# Altium schematic sheet ethernet.SchDoc (part 3 of 3)
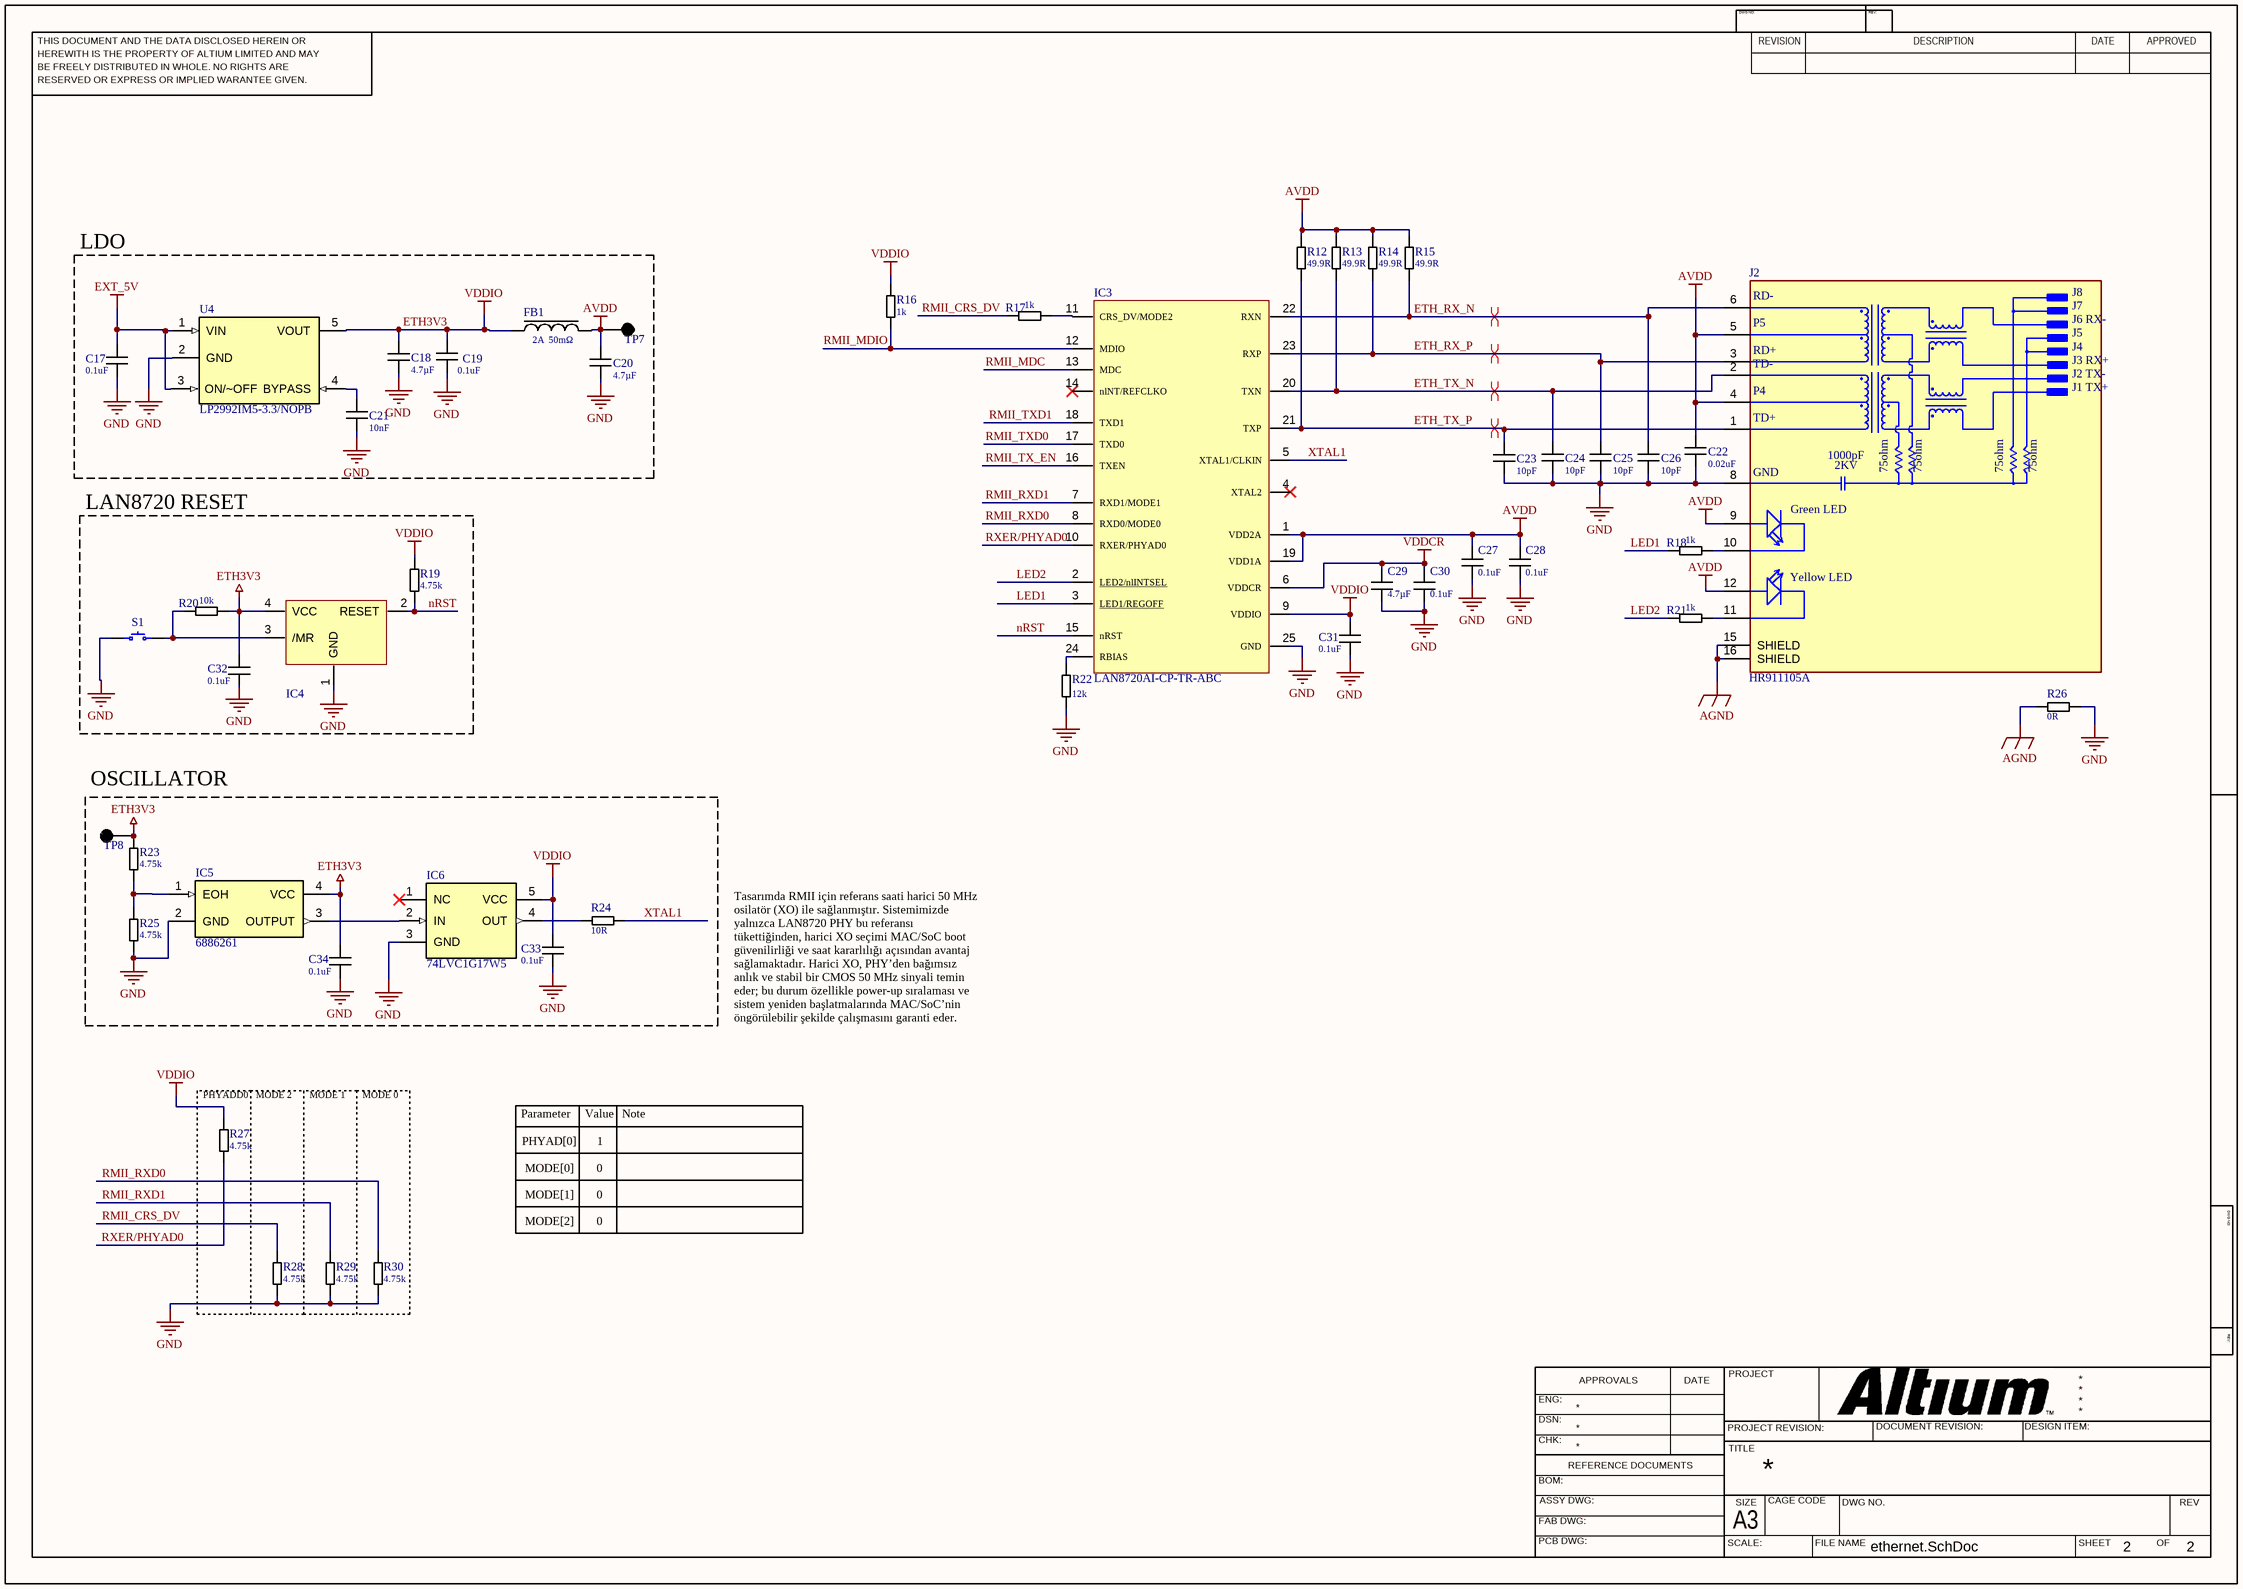
[diagram p2: ethernet.SchDoc]

## Library data of the parts (continued)
R12-R15 = RES 49.9 OHM 0603: 100Mw Thick Film Resistors 100Ppm/ 1% 49.9 0603 Chip Resistor Surface Mount Rohs; Manufacturer: Panasonic; Temperature Coefficient: 100ppm/°C; Voltage Rating: 75V; Supplier 1: Farnell; Manufacturer Part Number: ERJ-3EKF49R9V; RoHS: Compliant; Category: Chip SMD Resistors; Stock 1: 255000; Pricing 1: 5000=0,0084 (EUR); Case/Package: 0603; Case Code (Imperial): 0603; China RoHS: Non-Compliant; Composition: Thick Film; Contact Plating: Tin; Depth: 800µm; Features: Automotive AEC-Q200; Height: 450µm; Length: 1.6mm; Lifecycle Status: Production; Max Operating Temperature: 155°C; Max Power Dissipation: 100mW; Military Standard: Not; Min Operating Temperature: -55°C; Mount: Surface Mount; Number of Terminals: 2; Number of Terminations: 2; Packaging: Cut Tape; Power Dissipation: 100mW; Power Rating: 100mW; Radiation Hardening: No; REACH SVHC: Yes; Schedule B: 8533210045, 8533210045|8533210045|8533210045|8533210045|8533210045, 8533210045|8533210045|8533210045|8533210045|8533210045|8533210045, 8533210045|8533210045|8533210045|8533210045|8533210045|8533210045|8533210045|8533210045; Termination: SMD/SMT; Tolerance: 1%; Width: 800µm; Working Voltage: 75V; ComponentLink1URL: https://datasheet.octopart.com:443/ERJ-3EKF49R9V-Panasonic-datasheet-82288794.pdf?src-supplier=Panasonic+SCT; ComponentLink1Description: https://datasheet.octopart.com:443/ERJ-3EKF49R9V-Panasonic-datasheet-82288794.pdf?src-supplier=Panasonic+SCT; ComponentLink2URL: https://datasheet.octopart.com:443/ERJ-3EKF49R9V-Panasonic-datasheet-13266541.pdf?src-supplier=RS+(Formerly+Allied+Electronics); ComponentLink2Description: https://datasheet.octopart.com:443/ERJ-3EKF49R9V-Panasonic-datasheet-13266541.pdf?src-supplier=RS+(Formerly+Allied+Electronics); ComponentLink3URL: https://datasheet.octopart.com:443/ERJ-3EKF49R9V-Panasonic-datasheet-5313456.pdf?src-supplier=element14+APAC; ComponentLink3Description: https://datasheet.octopart.com:443/ERJ-3EKF49R9V-Panasonic-datasheet-5313456.pdf?src-supplier=element14+APAC; ComponentLink4URL: https://datasheet.octopart.com:443/ERJ-3EKF49R9V-Panasonic-datasheet-10025800.pdf?src-supplier=element14+APAC; ComponentLink4Description: https://datasheet.octopart.com:443/ERJ-3EKF49R9V-Panasonic-datasheet-10025800.pdf?src-supplier=element14+APAC; ComponentLink5URL: https://datasheet.octopart.com:443/ERJ-3EKF49R9V-Panasonic-datasheet-8853621.pdf?src-supplier=element14+APAC; ComponentLink5Description: https://datasheet.octopart.com:443/ERJ-3EKF49R9V-Panasonic-datasheet-8853621.pdf?src-supplier=element14+APAC; ComponentLink6URL: https://datasheet.octopart.com:443/ERJ-3EKF49R9V-Panasonic-datasheet-48891056.pdf?src-supplier=Newark; ComponentLink6Description: https://datasheet.octopart.com:443/ERJ-3EKF49R9V-Panasonic-datasheet-48891056.pdf?src-supplier=Newark; ComponentLink7URL: https://datasheet.octopart.com:443/ERJ-3EKF49R9V-Panasonic-datasheet-168681906.pdf?src-supplier=Newark; ComponentLink7Description: https://datasheet.octopart.com:443/ERJ-3EKF49R9V-Panasonic-datasheet-168681906.pdf?src-supplier=Newark; ComponentLink8URL: https://datasheet.octopart.com:443/ERJ-3EKF49R9V-Panasonic-datasheet-136608610.pdf?src-supplier=Farnell; ComponentLink8Description: https://datasheet.octopart.com:443/ERJ-3EKF49R9V-Panasonic-datasheet-136608610.pdf?src-supplier=Farnell; ComponentLink9URL: https://datasheet.octopart.com:443/ERJ-3EKF49R9V-Panasonic---ECG-datasheet-15994758.pdf?src-supplier=Farnell; ComponentLink9Description: https://datasheet.octopart.com:443/ERJ-3EKF49R9V-Panasonic---ECG-datasheet-15994758.pdf?src-supplier=Farnell; ComponentLink10URL: https://datasheet.octopart.com:443/ERJ-3EKF49R9V-Panasonic-datasheet-154766169.pdf?src-supplier=Master+Electronics; ComponentLink10Description: https://datasheet.octopart.com:443/ERJ-3EKF49R9V-Panasonic-datasheet-154766169.pdf?src-supplier=Master+Electronics; ComponentLink11URL: https://datasheet.octopart.com:443/ERJ3EKF49R9V-Panasonic-datasheet-138819429.pdf?src-supplier=Burklin+Elektronik; ComponentLink11Description: https://datasheet.octopart.com:443/ERJ3EKF49R9V-Panasonic-datasheet-138819429.pdf?src-supplier=Burklin+Elektronik; ComponentLink12URL: https://datasheet.octopart.com/ERJ-3EKF49R9V-Panasonic-datasheet-78375410.pdf; ComponentLink12Description: https://datasheet.octopart.com/ERJ-3EKF49R9V-Panasonic-datasheet-78375410.pdf; ComponentLink13URL: https://datasheet.octopart.com:443/ERJ-3EKF49R9V-Panasonic-datasheet-11542829.pdf?src-supplier=Arrow+Electronics; ComponentLink13Description: https://datasheet.octopart.com:443/ERJ-3EKF49R9V-Panasonic-datasheet-11542829.pdf?src-supplier=Arrow+Electronics; ComponentLink14URL: https://datasheet.octopart.com:443/ERJ-3EKF49R9V-Panasonic-datasheet-7538305.pdf?src-supplier=Jameco; ComponentLink14Description: https://datasheet.octopart.com:443/ERJ-3EKF49R9V-Panasonic-datasheet-7538305.pdf?src-supplier=Jameco; ComponentLink15URL: https://datasheet.octopart.com:443/ERJ-3EKF49R9V-Panasonic-datasheet-118621.pdf?src-supplier=DigiKey; ComponentLink15Description: https://datasheet.octopart.com:443/ERJ-3EKF49R9V-Panasonic-datasheet-118621.pdf?src-supplier=DigiKey; ComponentLink16URL: https://datasheet.octopart.com:443/ERJ-3EKF49R9V-Panasonic-datasheet-41391857.pdf?src-supplier=Electro+Sonic; ComponentLink16Description: https://datasheet.octopart.com:443/ERJ-3EKF49R9V-Panasonic-datasheet-41391857.pdf?src-supplier=Electro+Sonic; Supplier Part Number 1: 2692543
R16-R18 R21 = RES 1K OHM 0603: Res 1 kOhm, ±%1 SMD 0603; Manufacturer: Yageo; Tolerance: 1%; Temperature Coefficient: 100ppm/°C; Power Rating: 100mW; Voltage Rating: 50V; Supplier: Digi-Key; Supplier Part Number: 311-1.00KHRCT-ND; Manufacturer Part Number: RC0603FR-071KL; RoHS: Yes; Category: Chip SMD Resistors; Stock: 17822876; Pricing: 1=0,1, 10=0,019, 50=0,0112, 100=0,0093, 500=0,00622, 1000=0,00532 (USD); Case/Package: 0603; Contact Plating: Tin,Matte; Case Code (Imperial): 0603; Case Code (Metric): 1608; Min Operating Temperature: -55°C; Max Operating Temperature: 155°C; Resistor Type: Thick Film; Packaging: Tape and Reel; Termination: SMD/SMT; Features: Moisture Resistant; Series: RC; Max Power Dissipation: 100mW; Number of Terminations: 2; Technology: THICK FILM; Resistance Tolerance: 1%; Construction: Rectangular; Length: 1.6mm; Height: 0.45mm; Depth: 0.8mm; Reach SVHC Compliant: No; Lead Free: 5697LeadFree; Military Standard: Not; RoHS Compliant: Yes
R19 R23 R25 R27-R30 = RES 4.75k OHM 0603: 100mW Thick Film Resistors 75V ±100ppm/℃ ±1% 475kΩ 0603 Chip Resistor - Surface Mount ROHS; Manufacturer: Yageo Group; Manufacturer Part Number: RC0603FR-07475KL; Temperature Coefficient: 100ppm/°C; Voltage Rating (DC): 50V; Supplier 1: Farnell; RoHS: Compliant; Category: Chip SMD Resistors; Stock 1: 4728; Pricing 1: 10=0,0086, 100=0,0067, 500=0,0063, 1000=0,0048, 2500=0,0037 (EUR); Case/Package: 0603; Case Code (Imperial): 0603; China RoHS: Non-Compliant; Composition: Thick Film; Depth: 800µm; Features: Moisture Resistant; Height: 450µm; Lead Free: Lead Free; Length: 1.6mm; Lifecycle Status: Production; Max Operating Temperature: 155°C; Max Power Dissipation: 100mW; Military Standard: Not; Min Operating Temperature: -55°C; Mount: Surface Mount; Number of Terminals: 2; Number of Terminations: 2; Power Dissipation: 100mW; Power Rating: 100mW; REACH SVHC: Yes; Schedule B: 8533210045, 8533210045|8533210045, 8533210045|8533210045|8533210045, 8533210045|8533210045|8533210045|8533210045; Termination: SMD/SMT; Tolerance: 1%; Voltage Rating: 75V; Width: 800µm; Working Voltage: 75V; ComponentLink1URL: https://datasheet.octopart.com:443/RC0603FR-07475KL-Yageo-datasheet-175887523.pdf?src-supplier=Newark; ComponentLink1Description: https://datasheet.octopart.com:443/RC0603FR-07475KL-Yageo-datasheet-175887523.pdf?src-supplier=Newark; ComponentLink2URL: https://datasheet.octopart.com:443/RC0603FR-07475KL-Yageo-datasheet-103092701.pdf?src-supplier=Upverter; ComponentLink2Description: https://datasheet.octopart.com:443/RC0603FR-07475KL-Yageo-datasheet-103092701.pdf?src-supplier=Upverter; ComponentLink3URL: https://datasheet.octopart.com:443/RC0603FR-07475KL-Yageo-datasheet-8328172.pdf?src-supplier=Burklin+Elektronik; ComponentLink3Description: https://datasheet.octopart.com:443/RC0603FR-07475KL-Yageo-datasheet-8328172.pdf?src-supplier=Burklin+Elektronik; ComponentLink4URL: https://datasheet.octopart.com:443/RC0603FR-07475KL-Yageo-datasheet-164759695.pdf?src-supplier=Future+Electronics; ComponentLink4Description: https://datasheet.octopart.com:443/RC0603FR-07475KL-Yageo-datasheet-164759695.pdf?src-supplier=Future+Electronics; ComponentLink5URL: https://datasheet.octopart.com:443/RC0603FR-07475KL-Yageo-datasheet-137700087.pdf?src-supplier=Future+Electronics; ComponentLink5Description: https://datasheet.octopart.com:443/RC0603FR-07475KL-Yageo-datasheet-137700087.pdf?src-supplier=Future+Electronics; ComponentLink6URL: https://datasheet.octopart.com:443/RC0603FR-07475KL-Yageo-datasheet-15599030.pdf?src-supplier=Future+Electronics; ComponentLink6Description: https://datasheet.octopart.com:443/RC0603FR-07475KL-Yageo-datasheet-15599030.pdf?src-supplier=Future+Electronics; ComponentLink7URL: https://datasheet.octopart.com:443/RC0603FR-07475KL-Yageo-datasheet-12596169.pdf?src-supplier=Future+Electronics; ComponentLink7Description: https://datasheet.octopart.com:443/RC0603FR-07475KL-Yageo-datasheet-12596169.pdf?src-supplier=Future+Electronics; ComponentLink8URL: https://datasheet.octopart.com:443/RC0603FR-07475KL-Yageo-datasheet-148775077.pdf?src-supplier=TME; ComponentLink8Description: https://datasheet.octopart.com:443/RC0603FR-07475KL-Yageo-datasheet-148775077.pdf?src-supplier=TME; ComponentLink9URL: https://datasheet.octopart.com/RC0603FR-07475KL-Yageo-datasheet-73766026.pdf; ComponentLink9Description: https://datasheet.octopart.com/RC0603FR-07475KL-Yageo-datasheet-73766026.pdf; ComponentLink10URL: https://datasheet.octopart.com:443/RC0603FR-07475KL-Yageo-datasheet-118562.pdf?src-supplier=DigiKey; ComponentLink10Description: https://datasheet.octopart.com:443/RC0603FR-07475KL-Yageo-datasheet-118562.pdf?src-supplier=DigiKey; ComponentLink11URL: http://sigma.octopart.com:80/conflict_mineral_statement/Yageo-company-3.pdf?src-supplier=Compliance+Statements; ComponentLink11Description: http://sigma.octopart.com:80/conflict_mineral_statement/Yageo-company-3.pdf?src-supplier=Compliance+Statements; ComponentLink12URL: http://sigma.octopart.com:80/rohs_statement/Yageo-company-2.pdf?src-supplier=Compliance+Statements; ComponentLink12Description: http://sigma.octopart.com:80/rohs_statement/Yageo-company-2.pdf?src-supplier=Compliance+Statements; Supplier Part Number 1: 3495849
R20 = RES 10k OHM 0603: Res 10k Ohm %1 SMD 0603; Manufacturer: Yageo; Designed by: Semih AŞÇI; Tolerance: 1%; Temperature Coefficient: 100ppm/°C; Voltage Rating (DC): 50V; Power Rating: 100mW; Voltage Rating: 75V; Supplier 1: Digi-Key; Manufacturer Part Number: RC0603FR-0710KL; RoHS: Yes; Category: Chip SMD Resistors; Stock 1: 18418266; Pricing 1: 5000=0,00312 (USD); Case/Package: 0603; Number of Pins: 2; Case Code (Imperial): 0603; Case Code (Metric): 1608; Weight: 7.1E-05oz; Size Code: 0603; Min Operating Temperature: -55°C; Max Operating Temperature: 155°C; Resistor Type: Thick Film; Packaging: Tape and Reel; Termination: SMD/SMT; Features: Moisture Resistant; Series: RC; Max Power Dissipation: 100mW; Number of Terminations: 2; Resistance Tolerance: 1%; Construction: Rectangular; Length: 1.6mm; Width: 0.8mm; Height: 0.45mm; Depth: 0.8mm; Lead Pitch: 0.3mm; REACH SVHC: Unknown; Lead Free: Lead Free; Military Standard: Not; RoHS Compliant: Yes; ComponentLink1URL: https://datasheet.ciiva.com/7660/38590-7660789.pdf?src-supplier=Element14; ComponentLink1Description: https://datasheet.ciiva.com/7660/38590-7660789.pdf?src-supplier=Element14; ComponentLink2URL: https://datasheet.ciiva.com/7983/443971-7983596.pdf?src-supplier=Element14; ComponentLink2Description: https://datasheet.ciiva.com/7983/443971-7983596.pdf?src-supplier=Element14; ComponentLink3URL: https://datasheet.ciiva.com/22747/443971-22747519.pdf?src-supplier=Element14; ComponentLink3Description: https://datasheet.ciiva.com/22747/443971-22747519.pdf?src-supplier=Element14; ComponentLink4URL: https://datasheet.ciiva.com/46440/1868787-46440891.pdf?src-supplier=Element14; ComponentLink4Description: https://datasheet.ciiva.com/46440/1868787-46440891.pdf?src-supplier=Element14; ComponentLink5URL: https://datasheet.ciiva.com/7746/1738695-7746239.pdf?src-supplier=Element14; ComponentLink5Description: https://datasheet.ciiva.com/7746/1738695-7746239.pdf?src-supplier=Element14; ComponentLink6URL: https://datasheet.ciiva.com/15189/getdatasheetpartid-409289-15189591.pdf?src-supplier=Verical; ComponentLink6Description: https://datasheet.ciiva.com/15189/getdatasheetpartid-409289-15189591.pdf?src-supplier=Verical; Supplier Part Number 1: 311-10.0KHRTR-ND
R22 = RES 12k OHM 603: Res 12K Ohm %5 SMD 0603; Manufacturer: Yageo; Tolerance: 5%; Temperature Coefficient: 100ppm/°C; Voltage Rating (DC): 50V; Power Rating: 100mW; Supplier: Digi-Key; Supplier Part Number: 311-12KGRCT-ND; Manufacturer Part Number: RC0603JR-0712KL; RoHS: Yes; Category: Chip SMD Resistors; Stock: 414380; Pricing: 1=0,1, 10=0,014, 50=0,0088, 100=0,0073, 500=0,00486, 1000=0,00415 (USD); Case/Package: 0603; Pins: 2; Case Code (Metric): 1608; Case Code (Imperial): 0603; Min Operating Temperature: -55°C; Max Operating Temperature: 155°C; Resistor Type: Thick Film; Packaging: Tape and Reel; Voltage Rating: 50V; Package Quantity: 1; Number of Terminations: 2; Termination: SMD/SMT; Max Power Dissipation: 100mW; Features: Moisture Resistant; Series: RC; Resistance Tolerance: 5%; Length: 0.063inch; Width: 0.031inch; Height: 0.022inch; Reach SVHC Compliant: No; Lead Free: Lead Free; RoHS Compliant: Yes; ComponentLink1URL: https://datasheet.ciiva.com/2452/pyu-r-int-thick-7-2452913.pdf?src-supplier=Digi-Key; ComponentLink1Description: https://datasheet.ciiva.com/2452/pyu-r-int-thick-7-2452913.pdf?src-supplier=Digi-Key; ComponentLink2URL: https://datasheet.ciiva.com/2452/pyu-r-int-thick-7-2452911.pdf?src-supplier=Digi-Key; ComponentLink2Description: https://datasheet.ciiva.com/2452/pyu-r-int-thick-7-2452911.pdf?src-supplier=Digi-Key; ComponentLink3URL: https://datasheet.ciiva.com/2452/pyu-r-int-thick-7-2452912.pdf?src-supplier=Digi-Key; ComponentLink3Description: https://datasheet.ciiva.com/2452/pyu-r-int-thick-7-2452912.pdf?src-supplier=Digi-Key; ComponentLink4URL: https://datasheet.ciiva.com/7746/443971-7746437.pdf?src-supplier=Element14; ComponentLink4Description: https://datasheet.ciiva.com/7746/443971-7746437.pdf?src-supplier=Element14; ComponentLink5URL: https://datasheet.ciiva.com/7746/443971-7746438.pdf?src-supplier=Element14; ComponentLink5Description: https://datasheet.ciiva.com/7746/443971-7746438.pdf?src-supplier=Element14
R24 = RES 10 OHM 0603: 100Mw Thick Film Resistors 5% 200Ppm/ 10 0603 Chip Resistor Surface Mount Rohs; Manufacturer: Yageo Group; Temperature Coefficient: 200ppm/°C; Voltage Rating: 75V; Voltage Rating (AC): 50V; Supplier 1: Farnell; Manufacturer Part Number: RC0603JR-0710RL; RoHS: Compliant; Category: Chip SMD Resistors; Stock 1: 219670; Pricing 1: 10=0,0153, 100=0,0115, 500=0,0104, 1000=0,008, 2500=0,0078 (EUR); Case/Package: 0603; Case Code (Imperial): 0603; China RoHS: Non-Compliant; Composition: Thick Film; Depth: 800µm; Height: 450µm; Lead Free: Lead Free; Length: 1.6mm; Lifecycle Status: Production; Max Operating Temperature: 155°C; Military Standard: Not; Min Operating Temperature: -55°C; Mount: Surface Mount; Number of Pins: 2; Number of Terminals: 2; Packaging: Tape & Reel; Power Dissipation: 100mW; Power Rating: 100mW; REACH SVHC: Yes; Schedule B: 8533210045, 8533210045|8533210045, 8533210045|8533210045|8533210045, 8533210045|8533210045|8533210045|8533210045; Termination: SMD/SMT; Tolerance: 5%; Voltage Rating (DC): 50V; Width: 800µm; Working Voltage: 75V; ComponentLink1URL: https://datasheet.octopart.com:443/RC0603JR-0710RL-Yageo-datasheet-175887523.pdf?src-supplier=Newark; ComponentLink1Description: https://datasheet.octopart.com:443/RC0603JR-0710RL-Yageo-datasheet-175887523.pdf?src-supplier=Newark; ComponentLink2URL: https://datasheet.octopart.com:443/RC0603JR-0710RL-Yageo-datasheet-8328172.pdf?src-supplier=Newark; ComponentLink2Description: https://datasheet.octopart.com:443/RC0603JR-0710RL-Yageo-datasheet-8328172.pdf?src-supplier=Newark; ComponentLink3URL: https://datasheet.octopart.com:443/RC0603JR-0710RL-Yageo-datasheet-34211833.pdf?src-supplier=Newark; ComponentLink3Description: https://datasheet.octopart.com:443/RC0603JR-0710RL-Yageo-datasheet-34211833.pdf?src-supplier=Newark; ComponentLink4URL: https://datasheet.octopart.com:443/RC0603JR-0710RL-Yageo-datasheet-141265859.pdf?src-supplier=Upverter; ComponentLink4Description: https://datasheet.octopart.com:443/RC0603JR-0710RL-Yageo-datasheet-141265859.pdf?src-supplier=Upverter; ComponentLink5URL: https://sigma.octopart.com:443/138820526/technical_drawing/Yageo-RC0603JR-0710RL.pdf?src-supplier=Upverter; ComponentLink5Description: https://sigma.octopart.com:443/138820526/technical_drawing/Yageo-RC0603JR-0710RL.pdf?src-supplier=Upverter; ComponentLink6URL: https://datasheet.octopart.com:443/RC0603JR-0710RL-Yageo-datasheet-98239111.pdf?src-supplier=Upverter; ComponentLink6Description: https://datasheet.octopart.com:443/RC0603JR-0710RL-Yageo-datasheet-98239111.pdf?src-supplier=Upverter; ComponentLink7URL: https://datasheet.octopart.com:443/RC0603JR-0710RL-Yageo-datasheet-62067350.pdf?src-supplier=element14+APAC; ComponentLink7Description: https://datasheet.octopart.com:443/RC0603JR-0710RL-Yageo-datasheet-62067350.pdf?src-supplier=element14+APAC; ComponentLink8URL: https://datasheet.octopart.com:443/RC0603JR-0710RL-Yageo-datasheet-164759695.pdf?src-supplier=Future+Electronics; ComponentLink8Description: https://datasheet.octopart.com:443/RC0603JR-0710RL-Yageo-datasheet-164759695.pdf?src-supplier=Future+Electronics; ComponentLink9URL: https://datasheet.octopart.com:443/RC0603JR-0710RL-Yageo-datasheet-137700087.pdf?src-supplier=Future+Electronics; ComponentLink9Description: https://datasheet.octopart.com:443/RC0603JR-0710RL-Yageo-datasheet-137700087.pdf?src-supplier=Future+Electronics; ComponentLink10URL: https://datasheet.octopart.com:443/RC0603JR0710RL-Yageo-datasheet-27584510.pdf?src-supplier=Future+Electronics; ComponentLink10Description: https://datasheet.octopart.com:443/RC0603JR0710RL-Yageo-datasheet-27584510.pdf?src-supplier=Future+Electronics; ComponentLink11URL: https://datasheet.octopart.com:443/RC0603JR-0710RL-Yageo-datasheet-17842380.pdf?src-supplier=Future+Electronics; ComponentLink11Description: https://datasheet.octopart.com:443/RC0603JR-0710RL-Yageo-datasheet-17842380.pdf?src-supplier=Future+Electronics; ComponentLink12URL: https://datasheet.octopart.com:443/RC0603JR-0710RL-Yageo-datasheet-15599030.pdf?src-supplier=Future+Electronics; ComponentLink12Description: https://datasheet.octopart.com:443/RC0603JR-0710RL-Yageo-datasheet-15599030.pdf?src-supplier=Future+Electronics; ComponentLink13URL: https://datasheet.octopart.com:443/RC0603JR-0710RL-Yageo-datasheet-12596169.pdf?src-supplier=Future+Electronics; ComponentLink13Description: https://datasheet.octopart.com:443/RC0603JR-0710RL-Yageo-datasheet-12596169.pdf?src-supplier=Future+Electronics; ComponentLink14URL: https://datasheet.octopart.com:443/RC0603JR-0710RL-Yageo-datasheet-79472498.pdf?src-supplier=Megastar; ComponentLink14Description: https://datasheet.octopart.com:443/RC0603JR-0710RL-Yageo-datasheet-79472498.pdf?src-supplier=Megastar; ComponentLink15URL: https://datasheet.octopart.com/RC0603JR-0710RL-Yageo-datasheet-73766026.pdf; ComponentLink15Description: https://datasheet.octopart.com/RC0603JR-0710RL-Yageo-datasheet-73766026.pdf; ComponentLink16URL: https://datasheet.octopart.com:443/RC0603JR-0710RL-Yageo-datasheet-30459151.pdf?src-supplier=Seeed+Studio; ComponentLink16Description: https://datasheet.octopart.com:443/RC0603JR-0710RL-Yageo-datasheet-30459151.pdf?src-supplier=Seeed+Studio; ComponentLink17URL: https://datasheet.octopart.com:443/RC0603JR-0710RL-Yageo-datasheet-118562.pdf?src-supplier=DigiKey; ComponentLink17Description: https://datasheet.octopart.com:443/RC0603JR-0710RL-Yageo-datasheet-118562.pdf?src-supplier=DigiKey; ComponentLink18URL: http://sigma.octopart.com:80/conflict_mineral_statement/Yageo-company-3.pdf?src-supplier=Compliance+Statements; ComponentLink18Description: http://sigma.octopart.com:80/conflict_mineral_statement/Yageo-company-3.pdf?src-supplier=Compliance+Statements; ComponentLink19URL: http://sigma.octopart.com:80/rohs_statement/Yageo-company-2.pdf?src-supplier=Compliance+Statements; ComponentLink19Description: http://sigma.octopart.com:80/rohs_statement/Yageo-company-2.pdf?src-supplier=Compliance+Statements; Supplier Part Number 1: 9233148
R26 = RES 0 OHM 0603: RES SMD 0 OHM JUMPER 1/10W 0603; Manufacturer: Yageo; Designed by: Semih AŞÇI; Tolerance: 1%; Power Rating: 100mW; Voltage Rating (DC): 50V; Temperature Coefficient: 200ppm/°C; Resistance Tolerance: 5%; Supplier 1: Digi-Key; Manufacturer Part Number: RC0603JR-070RL; RoHS: Yes; Category: Chip SMD Resistors; Stock 1: 2727203; Pricing 1: 5000=0,00224, 10000=0,00195, 25000=0,00171, 50000=0,00160 (USD); Case/Package: 0603; Number of Pins: 2; Contact Plating: Tin,Matte; Case Code (Imperial): 0603; Case Code (Metric): 1608; Size Code: 0603; Min Operating Temperature: -55°C; Max Operating Temperature: 155°C; Resistor Type: Thick Film; Packaging: Tape and Reel; Termination: SMD/SMT; Series: RC; Technology: THICK FILM; Package Quantity: 5000; Voltage Rating: 50V; Features: Moisture Resistant; Max Power Dissipation: 100mW; Number of Terminations: 2; Construction: Rectangular; Length: 1.6mm; Width: 0.8mm; Height: 0.45mm; Depth: 0.8mm; Radiation Hardening: No; REACH SVHC: No SVHC; Lead Free: Lead Free; RoHS Compliant: Yes; Military Standard: Not; Supplier Part Number 1: 311-0.0GRTR-ND
S1 = FSMSMTR: SWITCH TACTILE SPST-NO 0.05A 24V; Manufacturer: TE Connectivity ALCOSWITCH Switches; Actuator Height off PCB, Vertical: 4.57mm; Actuator Orientation: Top Actuated; Actuator Type: Standard; Contact Rating @ Voltage: 0.05A @ 24VDC; Illumination: Non-Illuminated; Operating Force: 180gf; Outline: 6.00mm x 3.50mm; Switch Function: Off-Mom; Part Number: FSMSMTR; Circuit: SPST-NO; ComponentLink1Description: Datasheet; ComponentLink1URL: https://www.te.com/commerce/DocumentDelivery/DDEController?Action=srchrtrv&DocNm=1437566-3&DocType=Customer+Drawing&DocLang=English; ComponentLink2Description: DigiKey Link; ComponentLink2URL: https://www.digikey.com/en/products/detail/te-connectivity-alcoswitch-switches/FSMSMTR/529671; LastUpdated: 3.06.2024 20:19:35; Lifecycle Status: Active; Minimum Order: 1; Mounting Type: Surface Mount; Operating Temperature: -35°C ~ 85°C; Packaging: TapeAndReel; Part Status: Active; Price: 0.20; Series: FSMSM; Supplier 1: DigiKey; Supplier Part Number 1: 450-1758-1-ND; Termination Style: Gull Wing
TP7 TP8 = Test Point: MS27478 - Connectors Receptacle Electrical Solder Mounting Solder Type Hermetic Seal 38999 Series II; Manufacturer: Keystone; Manufacturer Part Number: 5007; Body Material: Bronze, PBT; Hole Diameter: 1.6mm; Inside Diameter: 1.78mm; Insulation: Insulated; Number of Contacts: 1; Outside Diameter: 3.18mm; Plating: Silver; Supplier 1: Farnell; RoHS: Compliant; Category: Connectors; Stock 1: 36826; Pricing 1: 1=0,124, 25=0,118, 50=0,112, 100=0,108, 500=0,103, 1000=0,099 (EUR); Color: White; Contact Material: Bronze; Contact Plating: Tin; Flammability Rating: UL94 V-0; Height: 8.89mm; Housing Color: White; Lead Free: Lead Free; Length: 8.89mm; Lifecycle Status: Production; Material: Bronze, Nylon, Silver; Mount: PCB, Through Hole; Number of Ports: 1; Orientation: Straight; Packaging: Bulk; REACH SVHC: Yes; ComponentLink1URL: https://datasheet.octopart.com:443/5007-Keystone-datasheet-15716159.pdf?src-supplier=IHS; ComponentLink1Description: https://datasheet.octopart.com:443/5007-Keystone-datasheet-15716159.pdf?src-supplier=IHS; ComponentLink2URL: https://datasheet.octopart.com:443/5007-Keystone-datasheet-23674.pdf?src-supplier=element14; ComponentLink2Description: https://datasheet.octopart.com:443/5007-Keystone-datasheet-23674.pdf?src-supplier=element14; ComponentLink3URL: https://datasheet.octopart.com:443/5007-Keystone-datasheet-60278094.pdf?src-supplier=LKR; ComponentLink3Description: https://datasheet.octopart.com:443/5007-Keystone-datasheet-60278094.pdf?src-supplier=LKR; ComponentLink4URL: https://datasheet.octopart.com:443/5007-Keystone-datasheet-9590016.pdf?src-supplier=Sager+Electronics; ComponentLink4Description: https://datasheet.octopart.com:443/5007-Keystone-datasheet-9590016.pdf?src-supplier=Sager+Electronics; ComponentLink5URL: https://datasheet.octopart.com:443/5007-Keystone-datasheet-10925273.pdf?src-supplier=RS+(Formerly+Allied+Electronics); ComponentLink5Description: https://datasheet.octopart.com:443/5007-Keystone-datasheet-10925273.pdf?src-supplier=RS+(Formerly+Allied+Electronics); ComponentLink6URL: https://datasheet.octopart.com:443/5007-Keystone-datasheet-6528.pdf?src-supplier=RS+(Formerly+Allied+Electronics); ComponentLink6Description: https://datasheet.octopart.com:443/5007-Keystone-datasheet-6528.pdf?src-supplier=RS+(Formerly+Allied+Electronics); ComponentLink7URL: https://datasheet.octopart.com:443/5007-Keystone-datasheet-549598.pdf?src-supplier=Future+Electronics; ComponentLink7Description: https://datasheet.octopart.com:443/5007-Keystone-datasheet-549598.pdf?src-supplier=Future+Electronics; ComponentLink8URL: https://datasheet.octopart.com:443/5007-Keystone-datasheet-527775.pdf?src-supplier=Future+Electronics; ComponentLink8Description: https://datasheet.octopart.com:443/5007-Keystone-datasheet-527775.pdf?src-supplier=Future+Electronics; Supplier Part Number 1: 2301285
U4 = LP2992IM5-3.3: 250-mA, 16-V, low-dropout voltage regulator with enable 5-SOT-23 -40 to 125; Manufacturer: Texas Instruments; Manufacturer Lifecycle Status: ACTIVE; Accuracy: 4%; Current Rating: 250A; Dropout Voltage: 450mV; Max Input Voltage: 16V; Max Output Current: 250mA; Max Output Voltage: 3.3V; Min Input Voltage: 2.2V; Min Supply Voltage: 4.3V; Number of Channels: 1; Output Type: Fixed; Polarity: Positive; Quiescent Current: 1µA; Supplier 1: Arrow Electronics; Manufacturer Part Number: LP2992IM5-3.3/NOPB; RoHS: Compliant; Category: LDO Voltage Regulators; Stock 1: 861; Pricing 1: 1=0,7511, 10=0,638, 25=0,602, 100=0,559, 250=0,537, 500=0,488 (USD); Case/Package: SOT-23; Height: 1.45mm; Length: 2.9mm; Lifecycle Status: Production; Max Operating Temperature: 125°C; Max Supply Voltage: 16V; Min Operating Temperature: -40°C; Mount: Surface Mount; Nominal Output Voltage: 3.3V; Number of Outputs: 1; Number of Pins: 5; Number of Regulators: 1; Output Current: 250mA; Output Voltage: 3.3V; Output Voltage Accuracy: 4%; Packaging: Cut Tape; Radiation Hardening: No; REACH SVHC: No; Schedule B: 8542390000, 8542390000|8542390000|8542390000|8542390000|8542390000; Termination: SMD/SMT; Thickness: 1.2mm; Width: 1.6mm; ComponentLink1URL: https://sigma.octopart.com:443/177332311/technical_drawing/Texas-Instruments-LP2992IM5-3.3-NOPB.pdf?src-supplier=Texas+Instruments; ComponentLink1Description: https://sigma.octopart.com:443/177332311/technical_drawing/Texas-Instruments-LP2992IM5-3.3-NOPB.pdf?src-supplier=Texas+Instruments; ComponentLink2URL: https://octopart.com:443/opatz8j6/c1?t=ePFHYmVBLG-Qtyx1KZTLd8k_86-tHzkdkqHwWW00LrLYjqQaWm0XYeZM0xuXtoF55YkFCQBhIvhdnZNGiUMFFQbKqPEbxDG92oKpBIchORm33mKcog5RP3GzPRFSgWpPP3W20woiuameQ83SQ-Vx7BXlJf6lAZbohzRqoQUG64dtnIsCHFxuiQYcz2nU7TVhYnukJKLMm8fk-u_nxySQqq1ql1c9SJ_dU89peG_ywX_xf92b92jMswt1pjEORKK7SfzSnwAUzDB-gi2ZMBzWnngwvmCFQNV6UzD0PFjQmreBUcHehqvD1eez2WVfz0Cgx-Bd7s5tMt4AKp_9fvYBgiGvwm95S-MmigVdV6CuT6eM_qiyyEswuG1wJMtOS4XqTMvJ&src-supplier=Texas+Instruments; ComponentLink2Description: https://octopart.com:443/opatz8j6/c1?t=ePFHYmVBLG-Qtyx1KZTLd8k_86-tHzkdkqHwWW00LrLYjqQaWm0XYeZM0xuXtoF55YkFCQBhIvhdnZNGiUMFFQbKqPEbxDG92oKpBIchORm33mKcog5RP3GzPRFSgWpPP3W20woiuameQ83SQ-Vx7BXlJf6lAZbohzRqoQUG64dtnIsCHFxuiQYcz2nU7TVhYnukJKLMm8fk-u_nxySQqq1ql1c9SJ_dU89peG_ywX_xf92b92jMswt1pjEORKK7SfzSnwAUzDB-gi2ZMBzWnngwvmCFQNV6UzD0PFjQmreBUcHehqvD1eez2WVfz0Cgx-Bd7s5tMt4AKp_9fvYBgiGvwm95S-MmigVdV6CuT6eM_qiyyEswuG1wJMtOS4XqTMvJ&src-supplier=Texas+Instruments; ComponentLink3URL: https://sigma.octopart.com:443/175570406/technical_drawing/Texas-Instruments-LP2992IM5-3.3-NOPB.pdf?src-supplier=Texas+Instruments; ComponentLink3Description: https://sigma.octopart.com:443/175570406/technical_drawing/Texas-Instruments-LP2992IM5-3.3-NOPB.pdf?src-supplier=Texas+Instruments; ComponentLink4URL: https://sigma.octopart.com:443/169406034/technical_drawing/Texas-Instruments-LP2992IM5-3.3-NOPB.pdf?src-supplier=Texas+Instruments; ComponentLink4Description: https://sigma.octopart.com:443/169406034/technical_drawing/Texas-Instruments-LP2992IM5-3.3-NOPB.pdf?src-supplier=Texas+Instruments; ComponentLink5URL: https://sigma.octopart.com:443/155939316/technical_drawing/Texas-Instruments-LP2992IM5-3.3-NOPB.pdf?src-supplier=Texas+Instruments; ComponentLink5Description: https://sigma.octopart.com:443/155939316/technical_drawing/Texas-Instruments-LP2992IM5-3.3-NOPB.pdf?src-supplier=Texas+Instruments; ComponentLink6URL: https://sigma.octopart.com:443/102331370/technical_drawing/Texas-Instruments-LP2992IM5-3.3-NOPB.pdf?src-supplier=Texas+Instruments; ComponentLink6Description: https://sigma.octopart.com:443/102331370/technical_drawing/Texas-Instruments-LP2992IM5-3.3-NOPB.pdf?src-supplier=Texas+Instruments; ComponentLink7URL: https://datasheet.octopart.com:443/LP2992IM5-3.3-NOPB-Texas-Instruments-datasheet-37720425.pdf?src-supplier=Texas+Instruments; ComponentLink7Description: https://datasheet.octopart.com:443/LP2992IM5-3.3-NOPB-Texas-Instruments-datasheet-37720425.pdf?src-supplier=Texas+Instruments; ComponentLink8URL: https://sigma.octopart.com:443/49249325/technical_drawing/Texas-Instruments-LP2992IM5-3.3-NOPB.pdf?src-supplier=Texas+Instruments; ComponentLink8Description: https://sigma.octopart.com:443/49249325/technical_drawing/Texas-Instruments-LP2992IM5-3.3-NOPB.pdf?src-supplier=Texas+Instruments; ComponentLink9URL: https://datasheet.octopart.com:443/LP2992IM5-3.3-NOPB-Texas-Instruments-datasheet-14446569.pdf?src-supplier=Texas+Instruments; ComponentLink9Description: https://datasheet.octopart.com:443/LP2992IM5-3.3-NOPB-Texas-Instruments-datasheet-14446569.pdf?src-supplier=Texas+Instruments; ComponentLink10URL: https://datasheet.octopart.com:443/LP2992IM5-3.3-NOPB-Texas-Instruments-datasheet-36834617.pdf?src-supplier=Newark; ComponentLink10Description: https://datasheet.octopart.com:443/LP2992IM5-3.3-NOPB-Texas-Instruments-datasheet-36834617.pdf?src-supplier=Newark; ComponentLink11URL: https://datasheet.octopart.com:443/LP2992IM5-3.3-NOPB-Texas-Instruments-datasheet-32750587.pdf?src-supplier=Newark; ComponentLink11Description: https://datasheet.octopart.com:443/LP2992IM5-3.3-NOPB-Texas-Instruments-datasheet-32750587.pdf?src-supplier=Newark; ComponentLink12URL: https://datasheet.octopart.com:443/LP2992IM5-3.3-NOPB-Texas-Instruments-datasheet-33009874.pdf?src-supplier=Newark; ComponentLink12Description: https://datasheet.octopart.com:443/LP2992IM5-3.3-NOPB-Texas-Instruments-datasheet-33009874.pdf?src-supplier=Newark; ComponentLink13URL: https://datasheet.octopart.com:443/LP2992IM5-3.3-NOPB-Texas-Instruments-datasheet-23768432.pdf?src-supplier=Newark; ComponentLink13Description: https://datasheet.octopart.com:443/LP2992IM5-3.3-NOPB-Texas-Instruments-datasheet-23768432.pdf?src-supplier=Newark; ComponentLink14URL: https://datasheet.octopart.com:443/LP2992IM5-3.3/NOPB-Texas-Instruments-datasheet-10844338.pdf?src-supplier=Arrow+Electronics; ComponentLink14Description: https://datasheet.octopart.com:443/LP2992IM5-3.3/NOPB-Texas-Instruments-datasheet-10844338.pdf?src-supplier=Arrow+Electronics; ComponentLink15URL: https://datasheet.octopart.com:443/LP2992IM5-3.3/NOPB-Texas-Instruments-datasheet-17211.pdf?src-supplier=element14; ComponentLink15Description: https://datasheet.octopart.com:443/LP2992IM5-3.3/NOPB-Texas-Instruments-datasheet-17211.pdf?src-supplier=element14; ComponentLink16URL: https://datasheet.octopart.com:443/LP2992IM5-3.3-NOPB-Texas-Instruments-datasheet-81454359.pdf?src-supplier=Farnell; ComponentLink16Description: https://datasheet.octopart.com:443/LP2992IM5-3.3-NOPB-Texas-Instruments-datasheet-81454359.pdf?src-supplier=Farnell; ComponentLink17URL: https://datasheet.octopart.com:443/LP2992IM5-3.3-NOPB.-Texas-Instruments-datasheet-59336580.pdf?src-supplier=Farnell; ComponentLink17Description: https://datasheet.octopart.com:443/LP2992IM5-3.3-NOPB.-Texas-Instruments-datasheet-59336580.pdf?src-supplier=Farnell; ComponentLink18URL: https://datasheet.octopart.com:443/LP2992IM5-3.3-NOPB-Texas-Instruments-datasheet-21076780.pdf?src-supplier=Farnell; ComponentLink18Description: https://datasheet.octopart.com:443/LP2992IM5-3.3-NOPB-Texas-Instruments-datasheet-21076780.pdf?src-supplier=Farnell; ComponentLink19URL: https://datasheet.octopart.com:443/LP2992IM5-3.3-NOPB-Texas-Instruments-datasheet-164415551.pdf?src-supplier=Augswan; ComponentLink19Description: https://datasheet.octopart.com:443/LP2992IM5-3.3-NOPB-Texas-Instruments-datasheet-164415551.pdf?src-supplier=Augswan; ComponentLink20URL: http://sigma.octopart.com:80/conflict_mineral_statement/Texas-Instruments-company-63.pdf?src-supplier=Compliance+Statements; ComponentLink20Description: http://sigma.octopart.com:80/conflict_mineral_statement/Texas-Instruments-company-63.pdf?src-supplier=Compliance+Statements; ComponentLink21URL: http://sigma.octopart.com:80/reach_statement/Texas-Instruments-company-64.pdf?src-supplier=Compliance+Statements; ComponentLink21Description: http://sigma.octopart.com:80/reach_statement/Texas-Instruments-company-64.pdf?src-supplier=Compliance+Statements; Supplier Part Number 1: LP2992IM5-3.3/NOPB